# Altium project FMC_AWG_Common.PrjPCB (part 1 of 5)
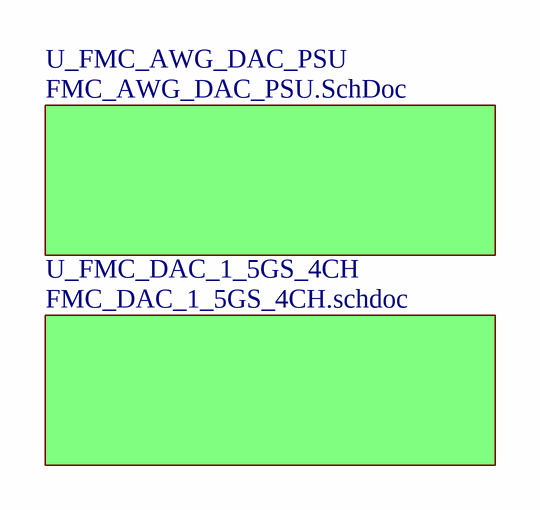
[diagram p0: FMC_AWG_Common.SchDoc]
13 sheets, 492 parts. Net scope: hierarchical (ports join the sheet entries above them; power ports are global).
Board file: FMC_AWG_Common.PcbDoc
Sheets:
  FMC_AWG_Common.SchDoc
    U_FMC_AWG_DAC_PSU = FMC_AWG_DAC_PSU.SchDoc
      U_FMC_AWG_DAC_PSU_LDO = FMC_AWG_DAC_PSU_LDO.SchDoc
    U_FMC_DAC_1_5GS_4CH = FMC_DAC_1_5GS_4CH.schdoc
      U_PWR_Supply = AWG_PWR_Supply.SchDoc
      U_CLK_INPUT = CLK_INPUT.SchDoc
      U_DAC = DAC.SchDoc
      U_DAC_SUPPLY = DAC_SUPPLY.SchDoc
      U_DAC_FMC_connector = DAC_FMC_connector.SchDoc
      U_Driver_Filter0 = Driver_Filter.schdoc
      U_Driver_Filter1 = Driver_Filter.schdoc
      U_Driver_Filter2 = Driver_Filter.schdoc
      U_Driver_Filter3 = Driver_Filter.schdoc
      U_EEPROM_Temp = EEPROM_Temp.SchDoc
      U_Translators_AWG = Translators_AWG.SchDoc
      U_IO_CTRL = IO_CTRL.SchDoc

## Sheet FMC_AWG_Common.SchDoc: Shuttler
size 420 x 297 mm; Author: G.Kasprowicz; CompanyName: WUT ISE; DrawnBy: G.Kasprowicz; Organization: WUT ISE; Address1: PW ISE; Address2: Nowowiejska 15/19 00-665 Warsaw; Address3: gkasprow@gmail.com; DocumentNumber: 10; Revision: 2; SheetNumber: 10; SheetTotal: 12; ModifiedBy: -; CheckedDate: -; Title2: Power supply; DivGrp: WUT ISE; Designer: G.Kasprowicz; ModifiedDate: -; ProjectName: Sensor Box

### Sub-sheets
U_FMC_AWG_DAC_PSU = FMC_AWG_DAC_PSU.SchDoc: no entries
U_FMC_DAC_1_5GS_4CH = FMC_DAC_1_5GS_4CH.schdoc: no entries

### Notes on the sheet
- Project/Equipment
- Document
- Designer
- Drawn by
- Check.by
- Copyright WUT ISE 2018.
  This documentation describes Open Hardware and is licensed under the CERN OHL v.1.1. You may redistribute and modify this documentation under the terms of the CERN OHL v.1.1. (http://ohwr.org/CERNOHL). This documentation is distributed WITHOUT ANY EXPRESS OR IMPLIED WARRANTY, INCLUDING OF MERCHANTABILITY, SATISFACTORY QUALITY AND FITNESS FOR A PARTICULAR PURPOSE. Please see the CERN OHL v.1.1 for applicable conditions.
- Contact
- File
- Last Mod.
- Print Date
- Sheet
- Size
- A3
- of
- Rev

## Sheet FMC_AWG_DAC_PSU.SchDoc: FMC DAC 1.5GS 4CH
size 420 x 297 mm; Author: G.Kasprowicz; CompanyName: WUT ISE; DrawnBy: G.Kasprowicz; Organization: WUT ISE; Address1: PW ISE; Address2: Nowowiejska 15/19 00-665 Warsaw; Address3: gkasprow@gmail.com; DocumentNumber: 10; Revision: 1; SheetNumber: 10; SheetTotal: 12; ModifiedBy: -; CheckedDate: -; Title2: Power supply; DivGrp: WUT ISE; Designer: G.Kasprowicz; ModifiedDate: -; ProjectName: Sensor Box
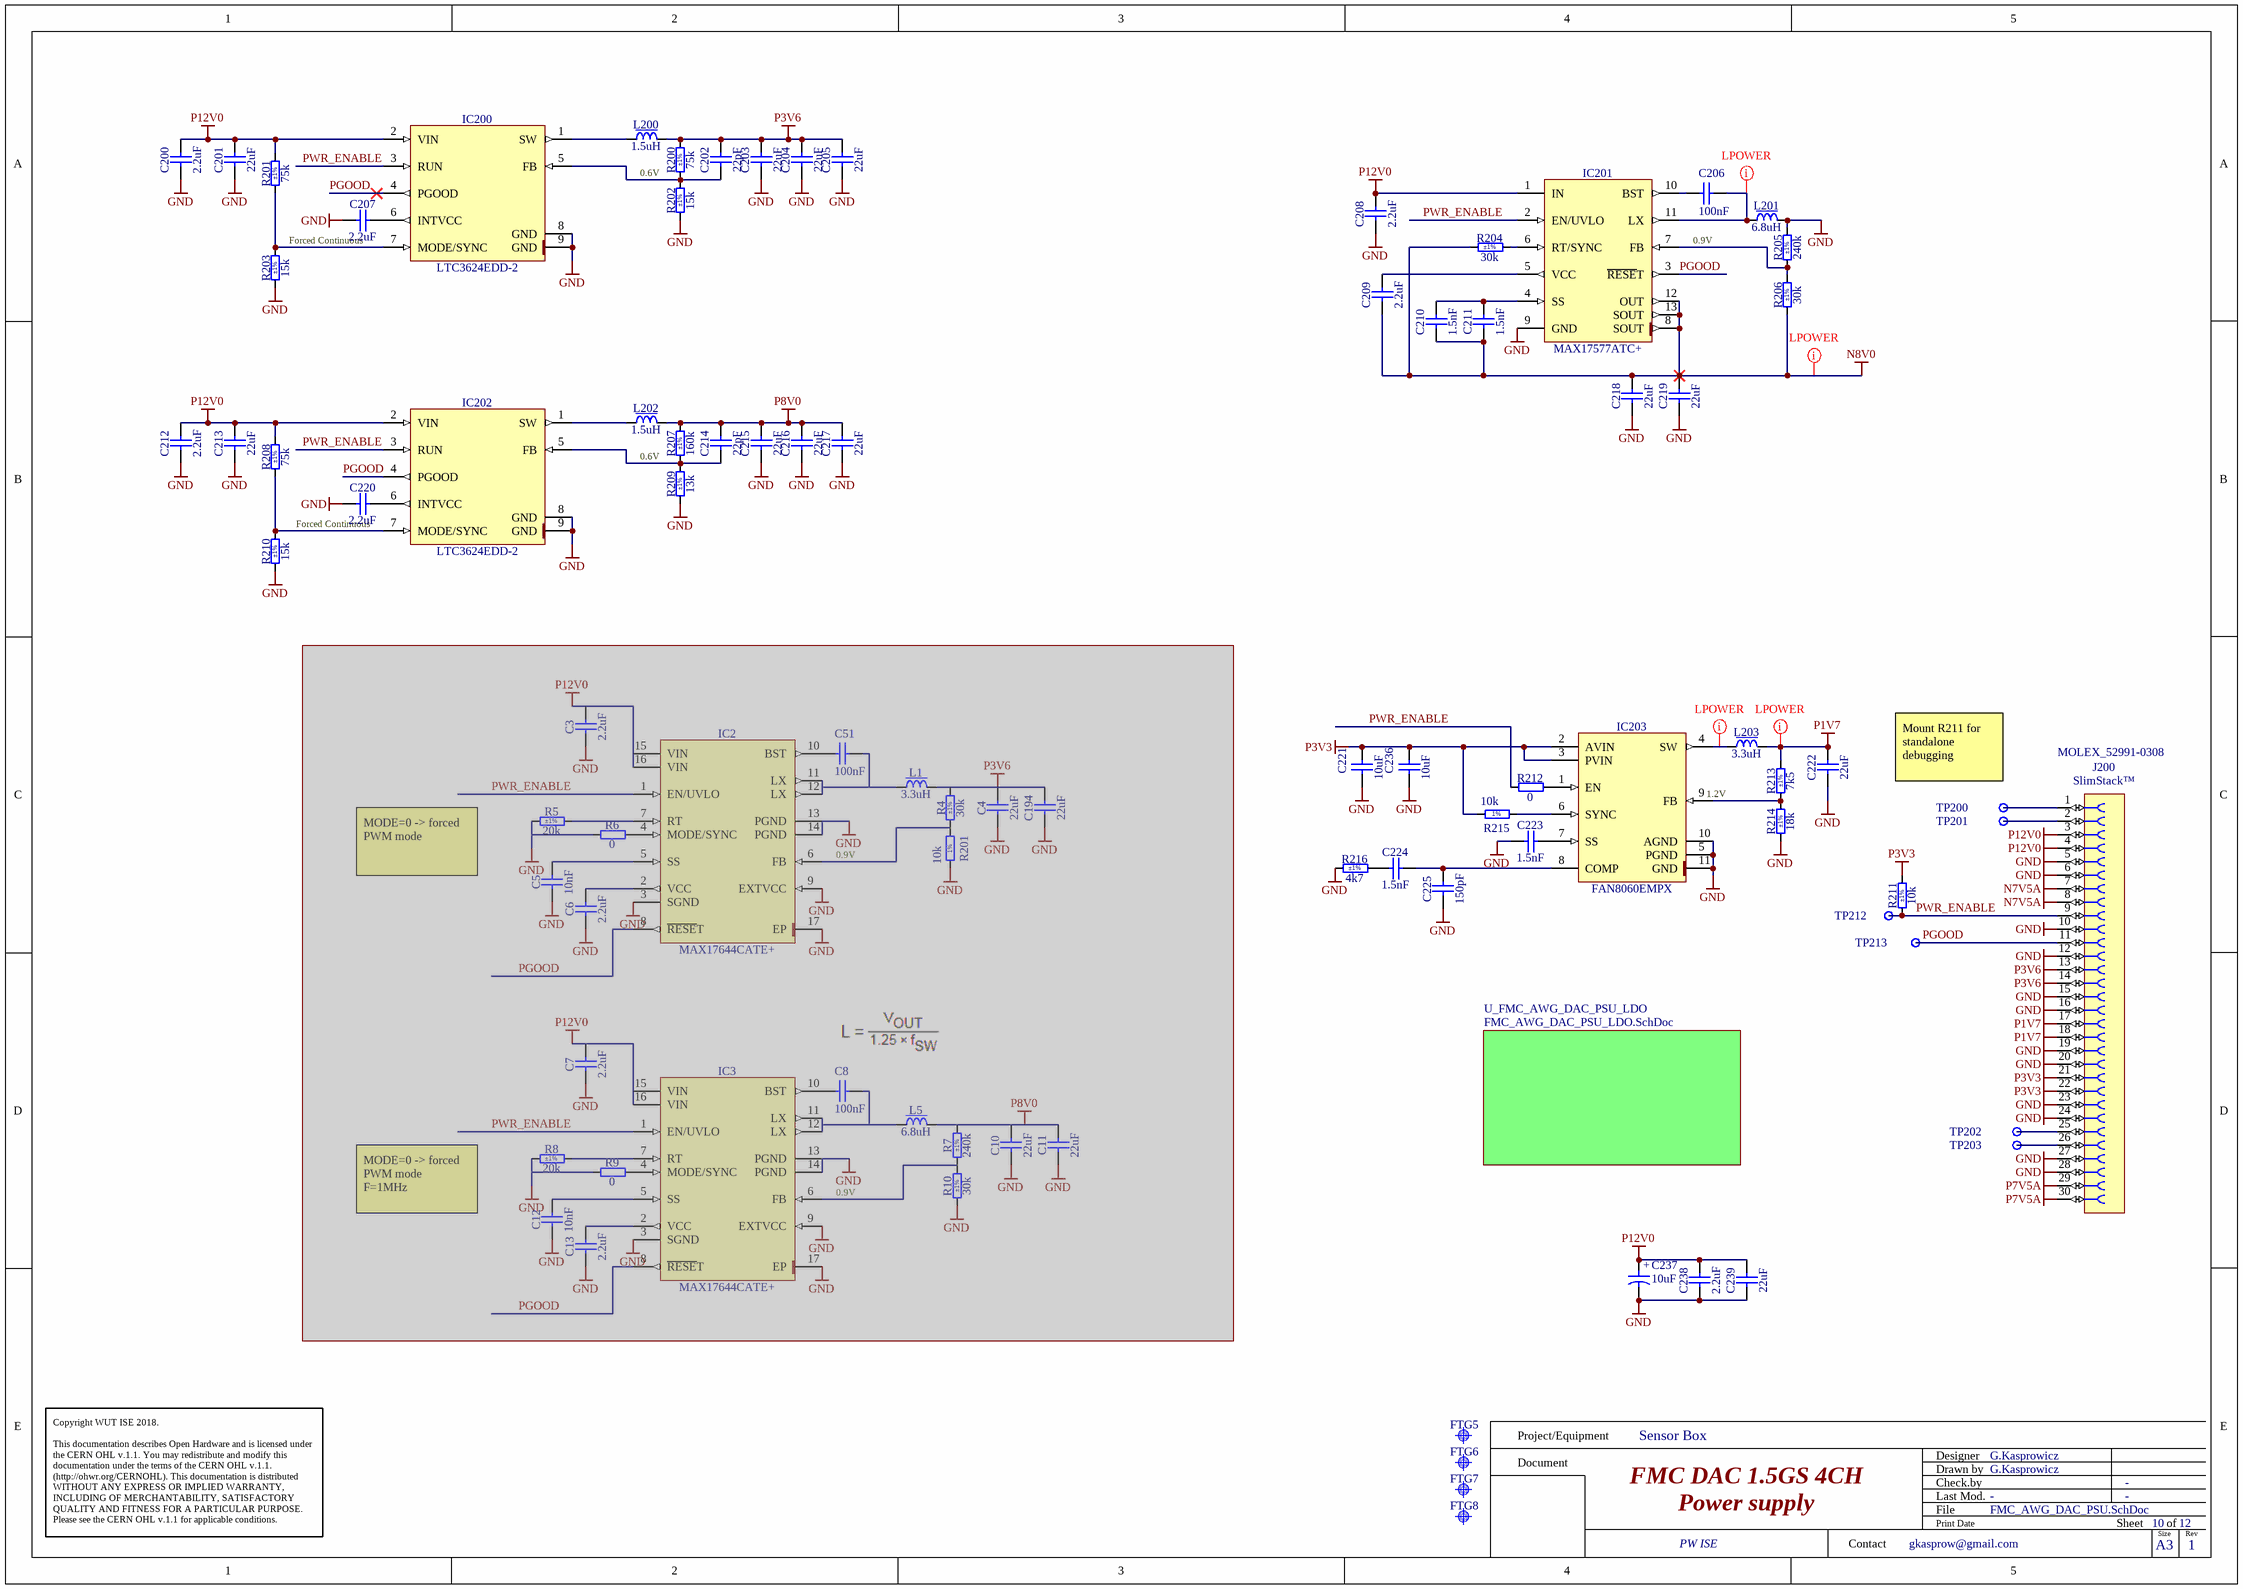
[diagram p1: FMC_AWG_DAC_PSU.SchDoc]

### Parts
(Parts that share a designator on the sheet are numbered #1, #2 ... from top to bottom, then left to right.)
C3#1  2.2uF  [CAPC1608X87N]  (masked out: inside a compile mask, not in the netlist)
C4#1  22uF  [CAPC2012X135N]  (masked out: inside a compile mask, not in the netlist)
C5#1  10nF  [CAPC1005X55N]  (masked out: inside a compile mask, not in the netlist)
C6#1  2.2uF  [CAPC1608X87N]  (masked out: inside a compile mask, not in the netlist)
C7#1  2.2uF  [CAPC1608X87N]  (masked out: inside a compile mask, not in the netlist)
C8#1  100nF  [CAPC1005X55N]  (masked out: inside a compile mask, not in the netlist)
C10#1  22uF  [CAPC2012X135N]  (masked out: inside a compile mask, not in the netlist)
C11#1  22uF  [CAPC2012X135N]  (masked out: inside a compile mask, not in the netlist)
C12#1  10nF  [CAPC1005X55N]  (masked out: inside a compile mask, not in the netlist)
C13#1  2.2uF  [CAPC1608X87N]  (masked out: inside a compile mask, not in the netlist)
C51#1  100nF  [CAPC1005X55N]  (masked out: inside a compile mask, not in the netlist)
C194  22uF  [CAPC2012X135N]  (masked out: inside a compile mask, not in the netlist)
C200  2.2uF  [CAPC1608X87N]
C201  22uF  [CAPC2012X135N]
C202  22pF  [CAPC1608X87N]
C203  22uF  [CAPC2012X135N]
C204  22uF  [CAPC2012X135N]
C205  22uF  [CAPC2012X135N]
C206  100nF  [CAPC1005X55N]
C207  2.2uF  [CAPC1005X55N]
C208  2.2uF  [CAPC1608X87N]
C209  2.2uF  [CAPC1608X87N]
C210  1.5nF  [CAPC1005X55N]
C211  1.5nF  [CAPC1005X55N]
C212  2.2uF  [CAPC1608X87N]
C213  22uF  [CAPC2012X135N]
C214  22pF  [CAPC1608X87N]
C215  22uF  [CAPC2012X135N]
C216  22uF  [CAPC2012X135N]
C217  22uF  [CAPC2012X135N]
C218  22uF  [CAPC2012X135N]
C219  22uF  [CAPC2012X135N]
C220  2.2uF  [CAPC1005X55N]
C221  10uF  [CAPC1608X80N]
C222  22uF  [CAPC2012X135N]
C223  1.5nF  [CAPC1005X55N]
C224  1.5nF  [CAPC1005X55N]
C225  150pF  [CAPC1005X55N]
C236  10uF  [CAPC1608X80N]
C237  10uF  [CAPMP3216X180N]
C238  2.2uF  [CAPC1608X87N]
C239  22uF  [CAPC2012X135N]
FTG5  Use only in PCB  [FIDUCIAL_TOP_S100-200]  (value not drawn)  (no BOM)
FTG6  Use only in PCB  [FIDUCIAL_TOP_S100-200]  (value not drawn)  (no BOM)
FTG7  Use only in PCB  [FIDUCIAL_TOP_S100-200]  (value not drawn)  (no BOM)
FTG8  Use only in PCB  [FIDUCIAL_TOP_S100-200]  (value not drawn)  (no BOM)
IC2#1  MAX17644CATE+  [QFN50P300X300X80-17N-S125]  (masked out: inside a compile mask, not in the netlist)
IC3#1  MAX17644CATE+  [QFN50P300X300X80-17N-S125]  (masked out: inside a compile mask, not in the netlist)
IC200  LTC3624EDD-2  [SON50P300X300X80-9N-R175X248]
IC201  MAX17577ATC+  [SON50P300X300X80-13N-R180X260]
IC202  LTC3624EDD-2  [SON50P300X300X80-9N-R175X248]
IC203  FAN8060EMPX  [SON50P300X80_HS-11N]
J200  SlimStack™  [MOLEX_52991-0308]
L1#1  3.3uH  [INDM5552X200N]  (masked out: inside a compile mask, not in the netlist)
L5#1  6.8uH  [INDM6965X300N]  (masked out: inside a compile mask, not in the netlist)
L200  1.5uH  [INDM6965X300N]
L201  6.8uH  [INDM6965X300N]
L202  1.5uH  [INDM6965X300N]
L203  3.3uH  [INDM5552X200N]
R4#1  30k  Tolerance: ±1%  [RESC1005X40N]  (masked out: inside a compile mask, not in the netlist)
R5#1  20k  Tolerance: ±1%  [RESC1005X40N]  (masked out: inside a compile mask, not in the netlist)
R6#1  0  [RESC1005X40N]  (masked out: inside a compile mask, not in the netlist)
R7#1  240k  Tolerance: ±1%  [RESC1005X40N]  (masked out: inside a compile mask, not in the netlist)
R8#1  20k  Tolerance: ±1%  [RESC1005X40N]  (masked out: inside a compile mask, not in the netlist)
R9#1  0  [RESC1005X40N]  (masked out: inside a compile mask, not in the netlist)
R10#1  30k  Tolerance: ±1%  [RESC1005X40N]  (masked out: inside a compile mask, not in the netlist)
R200  75k  Tolerance: ±1%  [RESC1005X40N]
R201#1  75k  Tolerance: ±1%  [RESC1005X40N]
R201#2  10k  [RESC1005X40N]  (masked out: inside a compile mask, not in the netlist)
R202  15k  Tolerance: ±1%  [RESC1005X40N]
R203  15k  Tolerance: ±1%  [RESC1005X40N]
R204  30k  Tolerance: ±1%  [RESC1005X40N]
R205  240k  Tolerance: ±1%  [RESC1005X40N]
R206  30k  Tolerance: ±1%  [RESC1005X40N]
R207  160k  Tolerance: ±1%  [RESC1005X40N]
R208  75k  Tolerance: ±1%  [RESC1005X40N]
R209  13k  Tolerance: ±1%  [RESC1005X40N]
R210  15k  Tolerance: ±1%  [RESC1005X40N]
R211  10k  Tolerance: ±1%  [RESC1005X40N]
R212  0  [RESC1005X40N]
R213  7k5  Tolerance: ±1%  [RESC1005X40N]
R214  18k  Tolerance: ±1%  [RESC1005X40N]
R215  10k  [RESC1005X40N]
R216  4k7  Tolerance: ±1%  [RESC1005X40N]
TP200  Test Point  [TPS127]  (value not drawn)  (no BOM)
TP201  Test Point  [TPS127]  (value not drawn)  (no BOM)
TP202  Test Point  [TPS127]  (value not drawn)  (no BOM)
TP203  Test Point  [TPS127]  (value not drawn)  (no BOM)
TP212  Test Point  [TPS127]  (value not drawn)  (no BOM)
TP213  Test Point  [TPS127]  (value not drawn)  (no BOM)

### Sub-sheets
U_FMC_AWG_DAC_PSU_LDO = FMC_AWG_DAC_PSU_LDO.SchDoc: no entries

### Nets
GND: C200.1 C201.1 C203.1 C204.1 C205.1 C207.1 C208.1 C212.1 C213.1 C215.1 C216.1 C217.1 C218.1 C219.1 C220.1 C221.1 C222.1 C223.1 C225.1 C236.1 C237.2 C238.1 C239.1 IC200.8(GND) IC200.9(GND) IC201.9(GND) IC202.8(GND) IC202.9(GND) IC203.5(PGND) IC203.10(AGND) IC203.11(GND) J200.5 J200.6 J200.10 J200.12 J200.15 J200.16 J200.19 J200.20 J200.23 J200.24 J200.27 J200.28 L201.2 R202.1 R203.1 R205.2 R209.1 R210.1 R214.1 R216.1
N7V5A: J200.7 J200.8
N8V0: C209.1 C210.1 C211.1 C218.2 C219.2 IC201.8(SOUT) IC201.12(OUT) IC201.13(SOUT) R204.1 R206.1
P1V7: C222.2 J200.17 J200.18 L203.2 R213.2
P3V3: C221.2 C236.2 IC203.2(AVIN) IC203.3(PVIN) J200.21 J200.22 R211.2 R215.1
P3V6: C202.2 C203.2 C204.2 C205.2 J200.13 J200.14 L200.2 R200.2
P7V5A: J200.29 J200.30
P8V0: C214.2 C215.2 C216.2 C217.2 L202.2 R207.2
P12V0: C200.2 C201.2 C208.2 C212.2 C213.2 C237.1 C238.2 C239.2 IC200.2(VIN) IC201.1(IN) IC202.2(VIN) J200.3 J200.4 R201#1.2 R208.2
PGOOD: IC200.4(PGOOD) IC201.3(~{RESE}T) IC202.4(PGOOD) J200.11 TP213.1
PWR_ENABLE: IC200.3(RUN) IC201.2(EN/UVLO) IC202.3(RUN) J200.9 R211.1 R212.1 TP212.1
NetC202_1: C202.1 IC200.5(FB) R200.1 R202.2
NetC206_1: C206.1 IC201.11(LX) L201.1
NetC206_2: C206.2 IC201.10(BST)
NetC207_2: C207.2 IC200.6(INTVCC)
NetC209_2: C209.2 IC201.5(VCC)
NetC210_2: C210.2 C211.2 IC201.4(SS)
NetC214_1: C214.1 IC202.5(FB) R207.1 R209.2
NetC220_2: C220.2 IC202.6(INTVCC)
NetC223_2: C223.2 IC203.7(SS)
NetC224_1: C224.1 R216.2
NetC224_2: C224.2 C225.2 IC203.8(COMP)
NetIC200_1: IC200.1(SW) L200.1
NetIC200_7: IC200.7(MODE/SYNC) R201#1.1 R203.2
NetIC201_6: IC201.6(RT/SYNC) R204.2
NetIC201_7: IC201.7(FB) R205.1 R206.2
NetIC202_1: IC202.1(SW) L202.1
NetIC202_7: IC202.7(MODE/SYNC) R208.1 R210.2
NetIC203_1: IC203.1(EN) R212.2
NetIC203_4: IC203.4(SW) L203.1
NetIC203_6: IC203.6(SYNC) R215.2
NetIC203_9: IC203.9(FB) R213.1 R214.2
NetJ200_1: J200.1 TP200.1
NetJ200_2: J200.2 TP201.1
NetJ200_25: J200.25 TP202.1
NetJ200_26: J200.26 TP203.1

### Layout directives
net class Lpower: N8V0, NetC206_1, NetIC203_4, P1V7

### Notes on the sheet
- 0.6V
- Forced Continuous
- 0.9V
- (near IC203) 1.2V
- Mount R211 for standalone debugging
- (near IC2#1) 0.9V
- MODE=0 -> forced PWM mode
- MODE=0 -> forced PWM mode
  F=1MHz
- (near IC3#1) 0.9V
- Project/Equipment
- Document
- Designer
- Drawn by
- Check.by
- Copyright WUT ISE 2018.
  This documentation describes Open Hardware and is licensed under the CERN OHL v.1.1. You may redistribute and modify this documentation under the terms of the CERN OHL v.1.1. (http://ohwr.org/CERNOHL). This documentation is distributed WITHOUT ANY EXPRESS OR IMPLIED WARRANTY, INCLUDING OF MERCHANTABILITY, SATISFACTORY QUALITY AND FITNESS FOR A PARTICULAR PURPOSE. Please see the CERN OHL v.1.1 for applicable conditions.
- Contact
- File
- Last Mod.
- Print Date
- Sheet
- Size
- A3
- of
- Rev
- (in symbol CTE3216-18_10UF_16V_20%_AVX_TCJ) +
- (in symbol R0402_10K_1%_0.0625W_100PPM) 1%

### Library data of the parts
C3#1 C6#1 C7#1 C13#1 C200 C208 C209 C212 C238 = CC0603_2.2UF_16V_10%_X5R: Non-polarised capacitor; Part Description: SMD Multilayer Chip Ceramic Capacitor; Manufacturer: GENERIC; Manufacturer1 Part Number: CC0603KRX5R7BB225; Voltage: 16V; TC: X5R; Tolerance: ±10%; Part Number: CC0603_2.2UF_16V_10%_X5R; Component Kind: Standard; Component Type: Standard; Pin Count: 2; Value: 2.2uF; Status: Preferred; Manufacturer Part Number: CC0603_2.2UF_16V_10%_X5R; Case: 0603; Mounted: Yes; Socket: No; SMD: Yes; Sense: No; Manufacturer1 Example: YAGEO PHYCOMP; Manufacturer1 ComponentHeight: 0.9mm; HelpURL: \\cern.ch\dfs\Applications\Altium\Datasheets\CC0805_X5R_PHYCOMP_HC.pdf; Author: CERN DEM JLC; CreateDate: 28.04.2011; LatestRevisionDate: 28.04.2011
C4#1 C10#1 C11#1 C194 C201 C203-C205 C213 C215-C219 C222 C239 = CC0805_22UF_16V_10%_X5R: Non-polarised capacitor; Part Description: SMD Multilayer Chip Ceramic Capacitor; Manufacturer: GENERIC; Manufacturer1 Part Number: C2012X5R1C226KT; Voltage: 16V; TC: X5R; Tolerance: ±10%; Part Number: CC0805_22UF_16V_10%_X5R; Component Kind: Standard; Component Type: Standard; Pin Count: 2; Value: 22uF; Status: Preferred; Manufacturer Part Number: CC0805_22UF_16V_10%_X5R; Case: 0805; Mounted: Yes; Socket: No; SMD: Yes; Sense: No; Manufacturer1 Example: TDK; Manufacturer1 ComponentHeight: 1.35mm; HelpURL: \\cern.ch\dfs\Applications\Altium\Datasheets\CC0805_X5R_TDK_C.pdf; Author: CERN DEM JLC; CreateDate: 25.10.2012; LatestRevisionDate: 25.10.2012
C5#1 C12#1 = CC0402_10NF_16V_10%_X7R: Non-polarised capacitor; Part Description: SMD Multilayer Chip Ceramic Capacitor; Manufacturer: GENERIC; Manufacturer1 Part Number: 223878715636; Voltage: 16V; TC: X7R; Tolerance: ±10%; Part Number: CC0402_10NF_16V_10%_X7R; Component Kind: Standard; Component Type: Standard; Pin Count: 2; Value: 10nF; Status: Not Recommended; Manufacturer Part Number: CC0402_10NF_16V_10%_X7R; Case: 0402; Mounted: Yes; Socket: No; SMD: Yes; Sense: No; Manufacturer1 Example: PHYCOMP; Manufacturer1 ComponentHeight: 0.55mm; HelpURL: \\cern.ch\dfs\Applications\Altium\Datasheets\CC0402_X7R_PHYCOMP.pdf; Author: CERN DEM JLC; CreateDate: 03.12.2007; LatestRevisionDate: 03.12.2007
C8#1 C51#1 C206 = CC0402_100NF_16V_10%_X5R: Non-polarised capacitor; Part Description: SMD Multilayer Chip Ceramic Capacitor; Manufacturer: GENERIC; Manufacturer1 Part Number: GRM155R61C104KA88D; Voltage: 16V; TC: X5R; Tolerance: ±10%; Part Number: CC0402_100NF_16V_10%_X5R; Component Kind: Standard; Component Type: Standard; Pin Count: 2; Value: 100nF; Status: None; Manufacturer Part Number: CC0402_100NF_16V_10%_X5R; Case: 0402; Mounted: Yes; Socket: No; SMD: Yes; Sense: No; Manufacturer1 Example: MURATA; Manufacturer1 ComponentHeight: 0.55mm; HelpURL: \\cern.ch\dfs\Applications\Altium\Datasheets\CC0402_X5R_MURATA_GRM.pdf; Author: CERN DEM JLC; CreateDate: 10.12.2013; LatestRevisionDate: 10.12.2013
C202 C214 = CC0603_22PF_50V_5%_NP0: Non-polarised capacitor; Part Description: SMD Multilayer Chip Ceramic Capacitor; Manufacturer: GENERIC; Manufacturer1 Part Number: 223886715229; Voltage: 50V; TC: C0G/NP0; Tolerance: ±5%; Part Number: CC0603_22PF_50V_5%_NP0; Component Kind: Standard; Component Type: Standard; Pin Count: 2; Value: 22pF; Status: Preferred; Manufacturer Part Number: CC0603_22PF_50V_5%_NP0; Case: 0603; Mounted: Yes; Socket: No; SMD: Yes; Sense: No; Manufacturer1 Example: PHYCOMP; Manufacturer1 ComponentHeight: 0.87mm; HelpURL: \\cern.ch\dfs\Applications\Altium\Datasheets\CC0603_NP0_PHYCOMP.pdf; Author: CERN DEM JLC; CreateDate: 03.12.2007; LatestRevisionDate: 03.12.2007
C207 C220 = CC0402_2.2UF_16V_10%_X5R: Non-polarised capacitor; Part Description: SMD Multilayer Chip Ceramic Capacitor; Manufacturer: GENERIC; Manufacturer1 Part Number: C1005X5R1C225K050; Voltage: 16V; TC: X5R; Tolerance: ±10%; Part Number: CC0402_2.2UF_16V_10%_X5R; Component Kind: Standard; Component Type: Standard; Pin Count: 2; Value: 2.2uF; Status: Preferred; Manufacturer Part Number: CC0402_2.2UF_16V_10%_X5R; Case: 0402; Mounted: Yes; Socket: No; SMD: Yes; Sense: No; Manufacturer1 Example: TDK; Manufacturer1 ComponentHeight: 0.55mm; HelpURL: \\cern.ch\dfs\Applications\Altium\Datasheets\CC0402_X5R_TDK_C.pdf; Author: CERN DEM BC; CreateDate: 08.02.2021; LatestRevisionDate: 08.02.2021
C210 C211 C223 C224 = CC0402_1.5NF_50V_5%_C0G: Non-polarised capacitor; Part Description: SMD Multilayer Chip Ceramic Capacitor; Manufacturer: GENERIC; Manufacturer1 Part Number: C0402C152J5GACTU; Voltage: 50V; TC: C0G/NP0; Tolerance: ±5%; Part Number: CC0402_1.5NF_50V_5%_C0G; Component Kind: Standard; Component Type: Standard; Pin Count: 2; Value: 1.5nF; Status: Preferred; Manufacturer Part Number: CC0402_1.5NF_50V_5%_C0G; Case: 0402; Mounted: Yes; Socket: No; SMD: Yes; Sense: No; Manufacturer1 Example: KEMET; Manufacturer1 ComponentHeight: 0.55mm; HelpURL: \\cern.ch\dfs\Applications\Altium\Datasheets\CC0402_C0G_KEMET_(Commercial Grade).pdf; Author: CERN DEM BC; CreateDate: 02.09.2019; LatestRevisionDate: 02.09.2019
C221 C236 = CC0603_10UF_10V_10%_X5R: Non-polarised capacitor; Part Description: SMD Multilayer Chip Ceramic Capacitor; Manufacturer: GENERIC; Manufacturer1 Part Number: GRM188R61A106KE69D; Voltage: 10V; TC: X5R; Tolerance: ±10%; Part Number: CC0603_10UF_10V_10%_X5R; Component Kind: Standard; Component Type: Standard; Pin Count: 2; Value: 10uF; Status: None; Manufacturer Part Number: CC0603_10UF_10V_10%_X5R; Case: 0603; Mounted: Yes; Socket: No; SMD: Yes; Sense: No; Manufacturer1 Example: MURATA; Manufacturer1 ComponentHeight: 0.8mm; HelpURL: \\cern.ch\dfs\Applications\Altium\Datasheets\CC0603_MURATA_GRM188R61A106KE69D.pdf; Author: CERN DEM JLC; CreateDate: 31/01/2017; LatestRevisionDate: 31/01/2017
C225 = CC0402_150PF_50V_5%_C0G: Non-polarised capacitor; Part Description: SMD Multilayer Chip Ceramic Capacitor; Manufacturer: GENERIC; Manufacturer1 Part Number: C0402C151J5GACTU; Voltage: 50V; TC: C0G/NP0; Tolerance: ±5%; Part Number: CC0402_150PF_50V_5%_C0G; Component Kind: Standard; Component Type: Standard; Pin Count: 2; Value: 150pF; Status: Preferred; Manufacturer Part Number: CC0402_150PF_50V_5%_C0G; Case: 0402; Mounted: Yes; Socket: No; SMD: Yes; Sense: No; Manufacturer1 Example: KEMET; Manufacturer1 ComponentHeight: 0.55mm; HelpURL: \\cern.ch\dfs\Applications\Altium\Datasheets\CC0402_C0G_KEMET_(Commercial Grade).pdf; Author: CERN DEM JLC; CreateDate: 03.12.2007; LatestRevisionDate: 22.04.2015
C237 = CTE3216-18_10UF_16V_20%_AVX_TCJ: Polarised capacitor; Part Description: ESR 0R200 Tantalum Solid Electrolytic Chip Capacitor with Conductive Polymer Electrode; Manufacturer: AVX; Manufacturer Part Number: TCJA106M016R0200; Voltage: 16V; Tolerance: ±20%; Part Number: CTE3216-18_10UF_16V_20%_AVX_TCJ; Component Kind: Standard; Component Type: Standard; Pin Count: 2; Value: 10uF; Status: Preferred; Case: A; Mounted: Yes; Socket: No; SMD: Yes; Sense: No; ComponentHeight: 1.8mm; HelpURL: \\cern.ch\dfs\Applications\Altium\Datasheets\CTE_AVX_TCJ.pdf; Author: CERN DEM JLC; CreateDate: 29.03.2012; LatestRevisionDate: 29.03.2012
FTG5-FTG8 = FIDUCIAL_TARGET_S100-200: Fiducial Target; Part Description: Square Fiducial Target, Top Layer, 1.0mm, Top Solder 2.0mm, Keepout =2.0mm; Mounted: No; Part Number: FIDUCIAL_TARGET_S100-200; Component Type: Standard (No BOM); Pin Count: 1; Family: Fiducial; Socket: No; SMD: Yes; Sense: No; Status: None; ComponentHeight: 0mm; HelpURL: Undefined; Author: CERN DEM JLC; CreateDate: 09.02.2010; LatestRevisionDate: 04.04.2012; PackageDescription: Square Fiducial Target, Top Layer, 1.0mm, Top Solder 2.0mm, Keepout =2.0mm
IC2#1 IC3#1 = MAX17644CATE+: 4.5V to 36V, 2.7A, High-Efficiency, Synchronous Step-Down DC-DC Converter; Manufacturer: MAXIM; PressFit: No; Bonding: No; Part Number: MAX17644CATE+; Component Kind: Standard; Component Type: Standard; Device: MAX17644CATE+; PackageDescription: QFN, 0.50mm Pitch, Square; 16 Pin, 3.00mm L X 3.00mm W X 0.80mm H body (w/Thermal Tab 1.25 X 1.25mm), IPC Medium Density; Part Description: 4.5V to 36V, 2.7A, High-Efficiency, Synchronous Step-Down DC-DC Converter; Manufacturer Part Number: MAX17644CATE+; Pin Count: 17; Case: QFN16; Mounted: Yes; Socket: No; SMD: Yes; Sense: No; ComponentHeight: 0.8mm; HelpURL: \\cern.ch\dfs\Applications\Altium\Datasheets\MAX17644.pdf; Author: CERN DEM HF; CreateDate: 22.10.2021; LatestRevisionDate: 22.10.2021
IC200 IC202 = LTC3624EDD-2: Adjustable, 2A, Synchronous Step-Down Regulator with 3.5µA Quiescent Current; Manufacturer: LINEAR TECHNOLOGY; PressFit: No; Bonding: No; Part Number: LTC3624EDD-2; Component Kind: Standard; Component Type: Standard; Device: LTC3624EDD-2; PackageDescription: SON, (DFN) 0.50mm Pitch; 8 Pin, 3.00mm W X 3.00mm L X 0.80mm H body (w/Thermal Tab 1.75 X 2.48mm), IPC Medium Density; Part Description: Adjustable, 2A, Synchronous Step-Down Regulator with 3.5µA Quiescent Current; Manufacturer Part Number: LTC3624EDD-2; Pin Count: 9; Case: SON8; Mounted: Yes; Socket: No; SMD: Yes; Sense: No; ComponentHeight: 0.8mm; HelpURL: \\cern.ch\dfs\Applications\Altium\Datasheets\LTC3624.pdf; Author: CERN DEM HF; CreateDate: 18.05.2022; LatestRevisionDate: 18.05.2022
IC201 = MAX17577ATC+: 4.5V to 60V, 1A High-Efficiency, Synchronous, Inverting Output DC-DC Converters; Manufacturer: MAXIM; PressFit: No; Bonding: No; Part Number: MAX17577ATC+; Component Kind: Standard; Component Type: Standard; Device: MAX17577ATC+; PackageDescription: SON, 0.50mm Pitch, 12-Pin, 3.00mm W  X 3.00mm L X 0.80mm H body, (w/Thermal Tab 1.80 X 2.60mm), IPC Medium Density; Part Description: 4.5V to 60V, 1A High-Efficiency, Synchronous, Inverting Output DC-DC Converters; Manufacturer Part Number: MAX17577ATC+; Pin Count: 13; Case: SON12; Mounted: Yes; Socket: No; SMD: Yes; Sense: No; ComponentHeight: 0.8mm; HelpURL: \\cern.ch\dfs\Applications\Altium\Datasheets\MAX17577ATC+.pdf; Author: CERN DEM HF; CreateDate: 22.10.2021; LatestRevisionDate: 22.10.2021
IC203 = PM_FAN8060: 2.5 to 5.5 V 1 A 1.2 MHz Step-Down DC/DC; Manufacturer: ON SEMICONDUCTOR; PressFit: No; Bonding: No; Part Number: FAN8060EMPX; Component Kind: Standard; Component Type: Standard; Device: FAN8060EMPX; PackageDescription: SON, 10-Leads, Body 3,00x3,00mm, Pitch 0,50mm, Thermal Pad 2,25x1,55mm, IPC Medium Density; Part Description: 2.5 to 5.5 V 1 A 1.2 MHz Step-Down DC/DC; Manufacturer Part Number: FAN8060EMPX; Pin Count: 13; Case: SON10; Mounted: Yes; Socket: No; SMD: Yes; Sense: No; ComponentHeight: 0.8mm; HelpURL: \\cern.ch\dfs\Applications\Altium\Datasheets\FAN5354MPX.pdf; Author: GK; CreateDate: 22.10.2021; LatestRevisionDate: 22.10.2021
J200 = MOLEX_52991-0308: Connector 30 Female; Part Description: 0.50mm Pitch SlimStack™ Dual Row 30 Circuits Surface Mount Vertical Receptacle (3.00 and 4.00mm Stacking Heights); Manufacturer: MOLEX; PressFit: No; Part Number: MOLEX_52991-0308; Component Kind: Standard; Component Type: Standard; Pin Count: 30; Family: SlimStack™; Mounted: Yes; Socket: No; SMD: Yes; Sense: No; Status: None; Manufacturer Part Number: 52991-0308; ComponentHeight: 2.27mm; HelpURL: \\cern.ch\dfs\Applications\Altium\Datasheets\MOLEX_52991-0308.pdf; Author: CERN DEM JLC; CreateDate: 28.08.2012; LatestRevisionDate: 28.08.2012
L1#1 L203 = IND2020_3.3UH_20%_VISHAY_IHLP-2020BZ-11: Inductor With Core; Part Description: Low Profile, High Current IHLP® Inductor; Manufacturer: VISHAY DALE; Manufacturer Part Number: IHLP2020BZER3R3M11; Power: 4.1A; Resistance: 0.0578R; Tolerance: ±20%; Part Number: IND2020_3.3UH_20%_VISHAY_IHLP-2020BZ-11; Component Kind: Standard; Component Type: Standard; Pin Count: 2; Value: 3.3uH; Case: 2020; Mounted: Yes; Socket: No; SMD: Yes; Sense: No; ComponentHeight: 2mm; HelpURL: \\cern.ch\dfs\Applications\Altium\Datasheets\IND2020_VISHAY_IHLP2020BZ-11.pdf; Author: CERN DEM MR; CreateDate: 04.12.2017; LatestRevisionDate: 04.12.2017
L5#1 L201 = IND2525_6.8UH_20%_VISHAY_IHLP-2525CZ-01: Inductor With Core; Part Description: Low Profile, High Current IHLP® Inductor; Manufacturer: VISHAY DALE; Manufacturer Part Number: IHLP2525CZER6R8M01; Power: 4.5A; Resistance: 0.054R; Tolerance: ±20%; Part Number: IND2525_6.8UH_20%_VISHAY_IHLP-2525CZ-01; Component Kind: Standard; Component Type: Standard; Pin Count: 2; Value: 6.8uH; Case: 2525; Mounted: Yes; Socket: No; SMD: Yes; Sense: No; ComponentHeight: 3mm; HelpURL: \\cern.ch\dfs\Applications\Altium\Datasheets\IND2525_VISHAY_IHLP-2525CZ-01.pdf; Author: CERN DEM MR; CreateDate: 29.06.2017; LatestRevisionDate: 29.06.2017
L200 L202 = IND2525_1.5UH_20%_VISHAY_IHLP-2525CZ: Inductor With Core; Part Description: Low Profile, High Current IHLP® Inductor; Manufacturer: VISHAY DALE; Manufacturer Part Number: IHLP2525CZER1R5M01; Power: 9A; Resistance: 0.014R; Tolerance: ±20%; Part Number: IND2525_1.5UH_20%_VISHAY_IHLP-2525CZ; Component Kind: Standard; Component Type: Standard; Pin Count: 2; Value: 1.5uH; Case: 2525; Mounted: Yes; Socket: No; SMD: Yes; Sense: No; ComponentHeight: 3mm; HelpURL: \\cern.ch\dfs\Applications\Altium\Datasheets\IND2525_VISHAY_IHLP-2525CZ.pdf; Author: CERN DEM JLC; CreateDate: 24.10.2012; LatestRevisionDate: 24.10.2012
R4#1 R10#1 R204 R206 = R0402_30K_1%_0.0625W_100PPM: Resistor - 1%; Part Description: General Purpose Thick Film Chip Resistor; Manufacturer: GENERIC; Manufacturer1 Part Number: 232270673003L; TC: ±100ppm/°C; PressFit: No; Part Number: R0402_30K_1%_0.0625W_100PPM; Component Kind: Standard; Component Type: Standard; Pin Count: 2; Value: 30k; Status: Not Recommended; Power: 0.0625W; Manufacturer Part Number: R0402_30K_1%_0.0625W_100PPM; Case: 0402; Mounted: Yes; Sense: No; Socket: No; SMD: Yes; Manufacturer1 Example: YAGEO PHYCOMP; Manufacturer1 ComponentHeight: 0.4mm; HelpURL: \\cern.ch\dfs\Applications\Altium\Datasheets\R0402_Phycomp_RC0402.pdf; Author: CERN DEM JLC; CreateDate: 03.12.2007; LatestRevisionDate: 17.10.2012
R5#1 R8#1 = R0402_20K_1%_0.0625W_100PPM: Resistor - 1%; Part Description: General Purpose Thick Film Chip Resistor; Manufacturer: GENERIC; Manufacturer1 Part Number: 232270672003L; TC: ±100ppm/°C; PressFit: No; Part Number: R0402_20K_1%_0.0625W_100PPM; Component Kind: Standard; Component Type: Standard; Pin Count: 2; Value: 20k; Status: Not Recommended; Power: 0.0625W; Manufacturer Part Number: R0402_20K_1%_0.0625W_100PPM; Case: 0402; Mounted: Yes; Sense: No; Socket: No; SMD: Yes; Manufacturer1 Example: YAGEO PHYCOMP; Manufacturer1 ComponentHeight: 0.4mm; HelpURL: \\cern.ch\dfs\Applications\Altium\Datasheets\R0402_Phycomp_RC0402.pdf; Author: CERN DEM JLC; CreateDate: 03.12.2007; LatestRevisionDate: 17.10.2012
R6#1 R9#1 R212 = R0402_0R_JUMPER: Resistor; Part Description: 1A (0.05R Max DC Resistance) Zero Ohm Jumper; Manufacturer: GENERIC; Manufacturer1 Part Number: 232270591001L; PressFit: No; Part Number: R0402_0R_JUMPER; Component Kind: Standard; Component Type: Standard; Pin Count: 2; Value: 0; Status: Not Recommended; Manufacturer Part Number: R0402_0R_JUMPER; Case: 0402; Mounted: Yes; Sense: No; Socket: No; SMD: Yes; Manufacturer1 Example: YAGEO PHYCOMP; Manufacturer1 ComponentHeight: 0.4mm; HelpURL: \\cern.ch\dfs\Applications\Altium\Datasheets\R0402_Phycomp_RC0402.pdf; Author: CERN DEM JLC
  R6#1 R9#1: CreateDate: 03.12.2007; LatestRevisionDate: 17.10.2012
  R212: CreateDate: 03/12/2007; LatestRevisionDate: 17/10/2012
R7#1 R205 = R0402_240K_1%_0.0625W_100PPM: Resistor - 1%; Part Description: General Purpose Thick Film Chip Resistor; Manufacturer: GENERIC; Manufacturer1 Part Number: 232270672404L; TC: ±100ppm/°C; PressFit: No; Part Number: R0402_240K_1%_0.0625W_100PPM; Component Kind: Standard; Component Type: Standard; Pin Count: 2; Value: 240k; Status: Not Recommended; Power: 0.0625W; Manufacturer Part Number: R0402_240K_1%_0.0625W_100PPM; Case: 0402; Mounted: Yes; Sense: No; Socket: No; SMD: Yes; Manufacturer1 Example: YAGEO PHYCOMP; Manufacturer1 ComponentHeight: 0.4mm; HelpURL: \\cern.ch\dfs\Applications\Altium\Datasheets\R0402_Phycomp_RC0402.pdf; Author: CERN DEM JLC; CreateDate: 03.12.2007; LatestRevisionDate: 17.10.2012
R200 R201#1 R208 = R0402_75K_1%_0.0625W_100PPM: Resistor - 1%; Part Description: General Purpose Thick Film Chip Resistor; Manufacturer: GENERIC; Manufacturer1 Part Number: 232270677503L; TC: ±100ppm/°C; PressFit: No; Part Number: R0402_75K_1%_0.0625W_100PPM; Component Kind: Standard; Component Type: Standard; Pin Count: 2; Value: 75k; Status: Not Recommended; Power: 0.0625W; Manufacturer Part Number: R0402_75K_1%_0.0625W_100PPM; Case: 0402; Mounted: Yes; Sense: No; Socket: No; SMD: Yes; Manufacturer1 Example: YAGEO PHYCOMP; Manufacturer1 ComponentHeight: 0.4mm; HelpURL: \\cern.ch\dfs\Applications\Altium\Datasheets\R0402_Phycomp_RC0402.pdf; Author: CERN DEM JLC; CreateDate: 03.12.2007; LatestRevisionDate: 17.10.2012
R201#2 R215 = R0402_10K_1%_0.0625W_100PPM: Resistor - 1%; Part Description: General Purpose Thick Film Chip Resistor; Manufacturer: GENERIC; Manufacturer1 Part Number: 232270671003L; PressFit: No; TC: ±100ppm/°C; Part Number: R0402_10K_1%_0.0625W_100PPM; Component Kind: Standard; Component Type: Standard; Pin Count: 2; Value: 10k; Status: Not Recommended; Manufacturer Part Number: R0402_10K_1%_0.0625W_100PPM; Case: 0402; Mounted: Yes; Sense: No; Socket: No; SMD: Yes; Manufacturer1 Example: YAGEO PHYCOMP; Manufacturer1 ComponentHeight: 0.4mm; HelpURL: \\cern.ch\dfs\Applications\Altium\Datasheets\R0402_Phycomp_RC0402.pdf; Author: CERN DEM JLC; CreateDate: 03-Dec-07; LatestRevisionDate: 17-Oct-12; Power: 0.0625W; Tolerance: ±1%
R202 R203 R210 = R0402_15K_1%_0.0625W_100PPM: Resistor - 1%; Part Description: General Purpose Thick Film Chip Resistor; Manufacturer: GENERIC; Manufacturer1 Part Number: CRCW040215K0FK; TC: ±100ppm/°C; PressFit: No; Part Number: R0402_15K_1%_0.0625W_100PPM; Component Kind: Standard; Component Type: Standard; Pin Count: 2; Value: 15k; Status: None; Power: 0.0625W; Manufacturer Part Number: R0402_15K_1%_0.0625W_100PPM; Case: 0402; Mounted: Yes; Sense: No; Socket: No; SMD: Yes; Manufacturer1 Example: VISHAY; Manufacturer1 ComponentHeight: 0.4mm; HelpURL: \\cern.ch\dfs\Applications\Altium\Datasheets\R0402_VISHAY_CRCW e3.pdf; Author: CERN DEM JMW; CreateDate: 06.07.2015; LatestRevisionDate: 06.07.2015
R207 = R0402_160K_1%_0.0625W_100PPM: Resistor - 1%; Part Description: General Purpose Thick Film Chip Resistor; Manufacturer: GENERIC; Manufacturer1 Part Number: 232270671604L; TC: ±100ppm/°C; PressFit: No; Part Number: R0402_160K_1%_0.0625W_100PPM; Component Kind: Standard; Component Type: Standard; Pin Count: 2; Value: 160k; Status: Not Recommended; Power: 0.0625W; Manufacturer Part Number: R0402_160K_1%_0.0625W_100PPM; Case: 0402; Mounted: Yes; Sense: No; Socket: No; SMD: Yes; Manufacturer1 Example: YAGEO PHYCOMP; Manufacturer1 ComponentHeight: 0.4mm; HelpURL: \\cern.ch\dfs\Applications\Altium\Datasheets\R0402_Phycomp_RC0402.pdf; Author: CERN DEM JLC; CreateDate: 03.12.2007; LatestRevisionDate: 17.10.2012
R209 = R0402_13K_1%_0.0625W_100PPM: Resistor - 1%; Part Description: General Purpose Thick Film Chip Resistor; Manufacturer: GENERIC; Manufacturer1 Part Number: 232270671303L; TC: ±100ppm/°C; PressFit: No; Part Number: R0402_13K_1%_0.0625W_100PPM; Component Kind: Standard; Component Type: Standard; Pin Count: 2; Value: 13k; Status: Not Recommended; Power: 0.0625W; Manufacturer Part Number: R0402_13K_1%_0.0625W_100PPM; Case: 0402; Mounted: Yes; Sense: No; Socket: No; SMD: Yes; Manufacturer1 Example: YAGEO PHYCOMP; Manufacturer1 ComponentHeight: 0.4mm; HelpURL: \\cern.ch\dfs\Applications\Altium\Datasheets\R0402_Phycomp_RC0402.pdf; Author: CERN DEM JLC; CreateDate: 03.12.2007; LatestRevisionDate: 17.10.2012
R211 = R0402_10K_1%_0.0625W_100PPM: Resistor - 1%; Part Description: General Purpose Thick Film Chip Resistor; Manufacturer: GENERIC; Manufacturer1 Part Number: 232270671003L; TC: ±100ppm/°C; PressFit: No; Part Number: R0402_10K_1%_0.0625W_100PPM; Component Kind: Standard; Component Type: Standard; Pin Count: 2; Value: 10k; Status: Not Recommended; Power: 0.0625W; Manufacturer Part Number: R0402_10K_1%_0.0625W_100PPM; Case: 0402; Mounted: Yes; Sense: No; Socket: No; SMD: Yes; Manufacturer1 Example: YAGEO PHYCOMP; Manufacturer1 ComponentHeight: 0.4mm; HelpURL: \\cern.ch\dfs\Applications\Altium\Datasheets\R0402_Phycomp_RC0402.pdf; Author: CERN DEM JLC; CreateDate: 03.12.2007; LatestRevisionDate: 17.10.2012
R213 = R0402_7K5_1%_0.0625W_100PPM: Resistor - 1%; Part Description: General Purpose Thick Film Chip Resistor; Manufacturer: GENERIC; Manufacturer1 Part Number: 232270677502L; TC: ±100ppm/°C; PressFit: No; Part Number: R0402_7K5_1%_0.0625W_100PPM; Component Kind: Standard; Component Type: Standard; Pin Count: 2; Value: 7k5; Status: Not Recommended; Power: 0.0625W; Manufacturer Part Number: R0402_7K5_1%_0.0625W_100PPM; Case: 0402; Mounted: Yes; Sense: No; Socket: No; SMD: Yes; Manufacturer1 Example: YAGEO PHYCOMP; Manufacturer1 ComponentHeight: 0.4mm; HelpURL: \\cern.ch\dfs\Applications\Altium\Datasheets\R0402_Phycomp_RC0402.pdf; Author: CERN DEM JLC; CreateDate: 03.12.2007; LatestRevisionDate: 17.10.2012
R214 = R0402_18K_1%_0.0625W_100PPM: Resistor - 1%; Part Description: General Purpose Thick Film Chip Resistor; Manufacturer: GENERIC; Manufacturer1 Part Number: 232270671803L; TC: ±100ppm/°C; PressFit: No; Part Number: R0402_18K_1%_0.0625W_100PPM; Component Kind: Standard; Component Type: Standard; Pin Count: 2; Value: 18k; Status: Not Recommended; Power: 0.0625W; Manufacturer Part Number: R0402_18K_1%_0.0625W_100PPM; Case: 0402; Mounted: Yes; Sense: No; Socket: No; SMD: Yes; Manufacturer1 Example: YAGEO PHYCOMP; Manufacturer1 ComponentHeight: 0.4mm; HelpURL: \\cern.ch\dfs\Applications\Altium\Datasheets\R0402_Phycomp_RC0402.pdf; Author: CERN DEM JLC; CreateDate: 03.12.2007; LatestRevisionDate: 17.10.2012
R216 = R0402_4K7_1%_0.0625W_100PPM: Resistor - 1%; Part Description: General Purpose Thick Film Chip Resistor; Manufacturer: GENERIC; Manufacturer1 Part Number: 232270674702L; TC: ±100ppm/°C; PressFit: No; Part Number: R0402_4K7_1%_0.0625W_100PPM; Component Kind: Standard; Component Type: Standard; Pin Count: 2; Value: 4k7; Status: Not Recommended; Power: 0.0625W; Manufacturer Part Number: R0402_4K7_1%_0.0625W_100PPM; Case: 0402; Mounted: Yes; Sense: No; Socket: No; SMD: Yes; Manufacturer1 Example: YAGEO PHYCOMP; Manufacturer1 ComponentHeight: 0.4mm; HelpURL: \\cern.ch\dfs\Applications\Altium\Datasheets\R0402_Phycomp_RC0402.pdf; Author: CERN DEM JLC; CreateDate: 03.12.2007; LatestRevisionDate: 17.10.2012
TP200-TP203 TP212 TP213 = SMD_PAD_1.27X1.27MM: Part Description: 1.27mm x 1.27mm PCB Copper Area (SMD Test Point); Mounted: No; Part Number: SMD_PAD_1.27X1.27MM; Component Type: Standard (No BOM); Pin Count: 1; Family: Test Point; Socket: No; SMD: Yes; Sense: No; Status: None; ComponentHeight: 0mm; HelpURL: Undefined; Author: CERN DEM JLC; CreateDate: 12.01.2008; LatestRevisionDate: 12.01.2008; PackageDescription: 1.27mm x 1.27mm PCB Copper Area (SMD Test Point)